# Altium schematic sheet ZynqPSDDR.SchDoc: Zynq PS DDR
size A3; Author: Carlos Barreiro; Organization: Escuela Técnica Superior de Ingeniería de Sistemas Informáticos de la Universidad Politécnica de Madrid; Address1: Campus Sur de la Universidad Politécnica de Madrid; Address2: Calle de Alan Turing, s/nº; Address3: Madrid 28031; Address4: España; Revision: 1.0; SheetNumber: 1; SheetTotal: 10
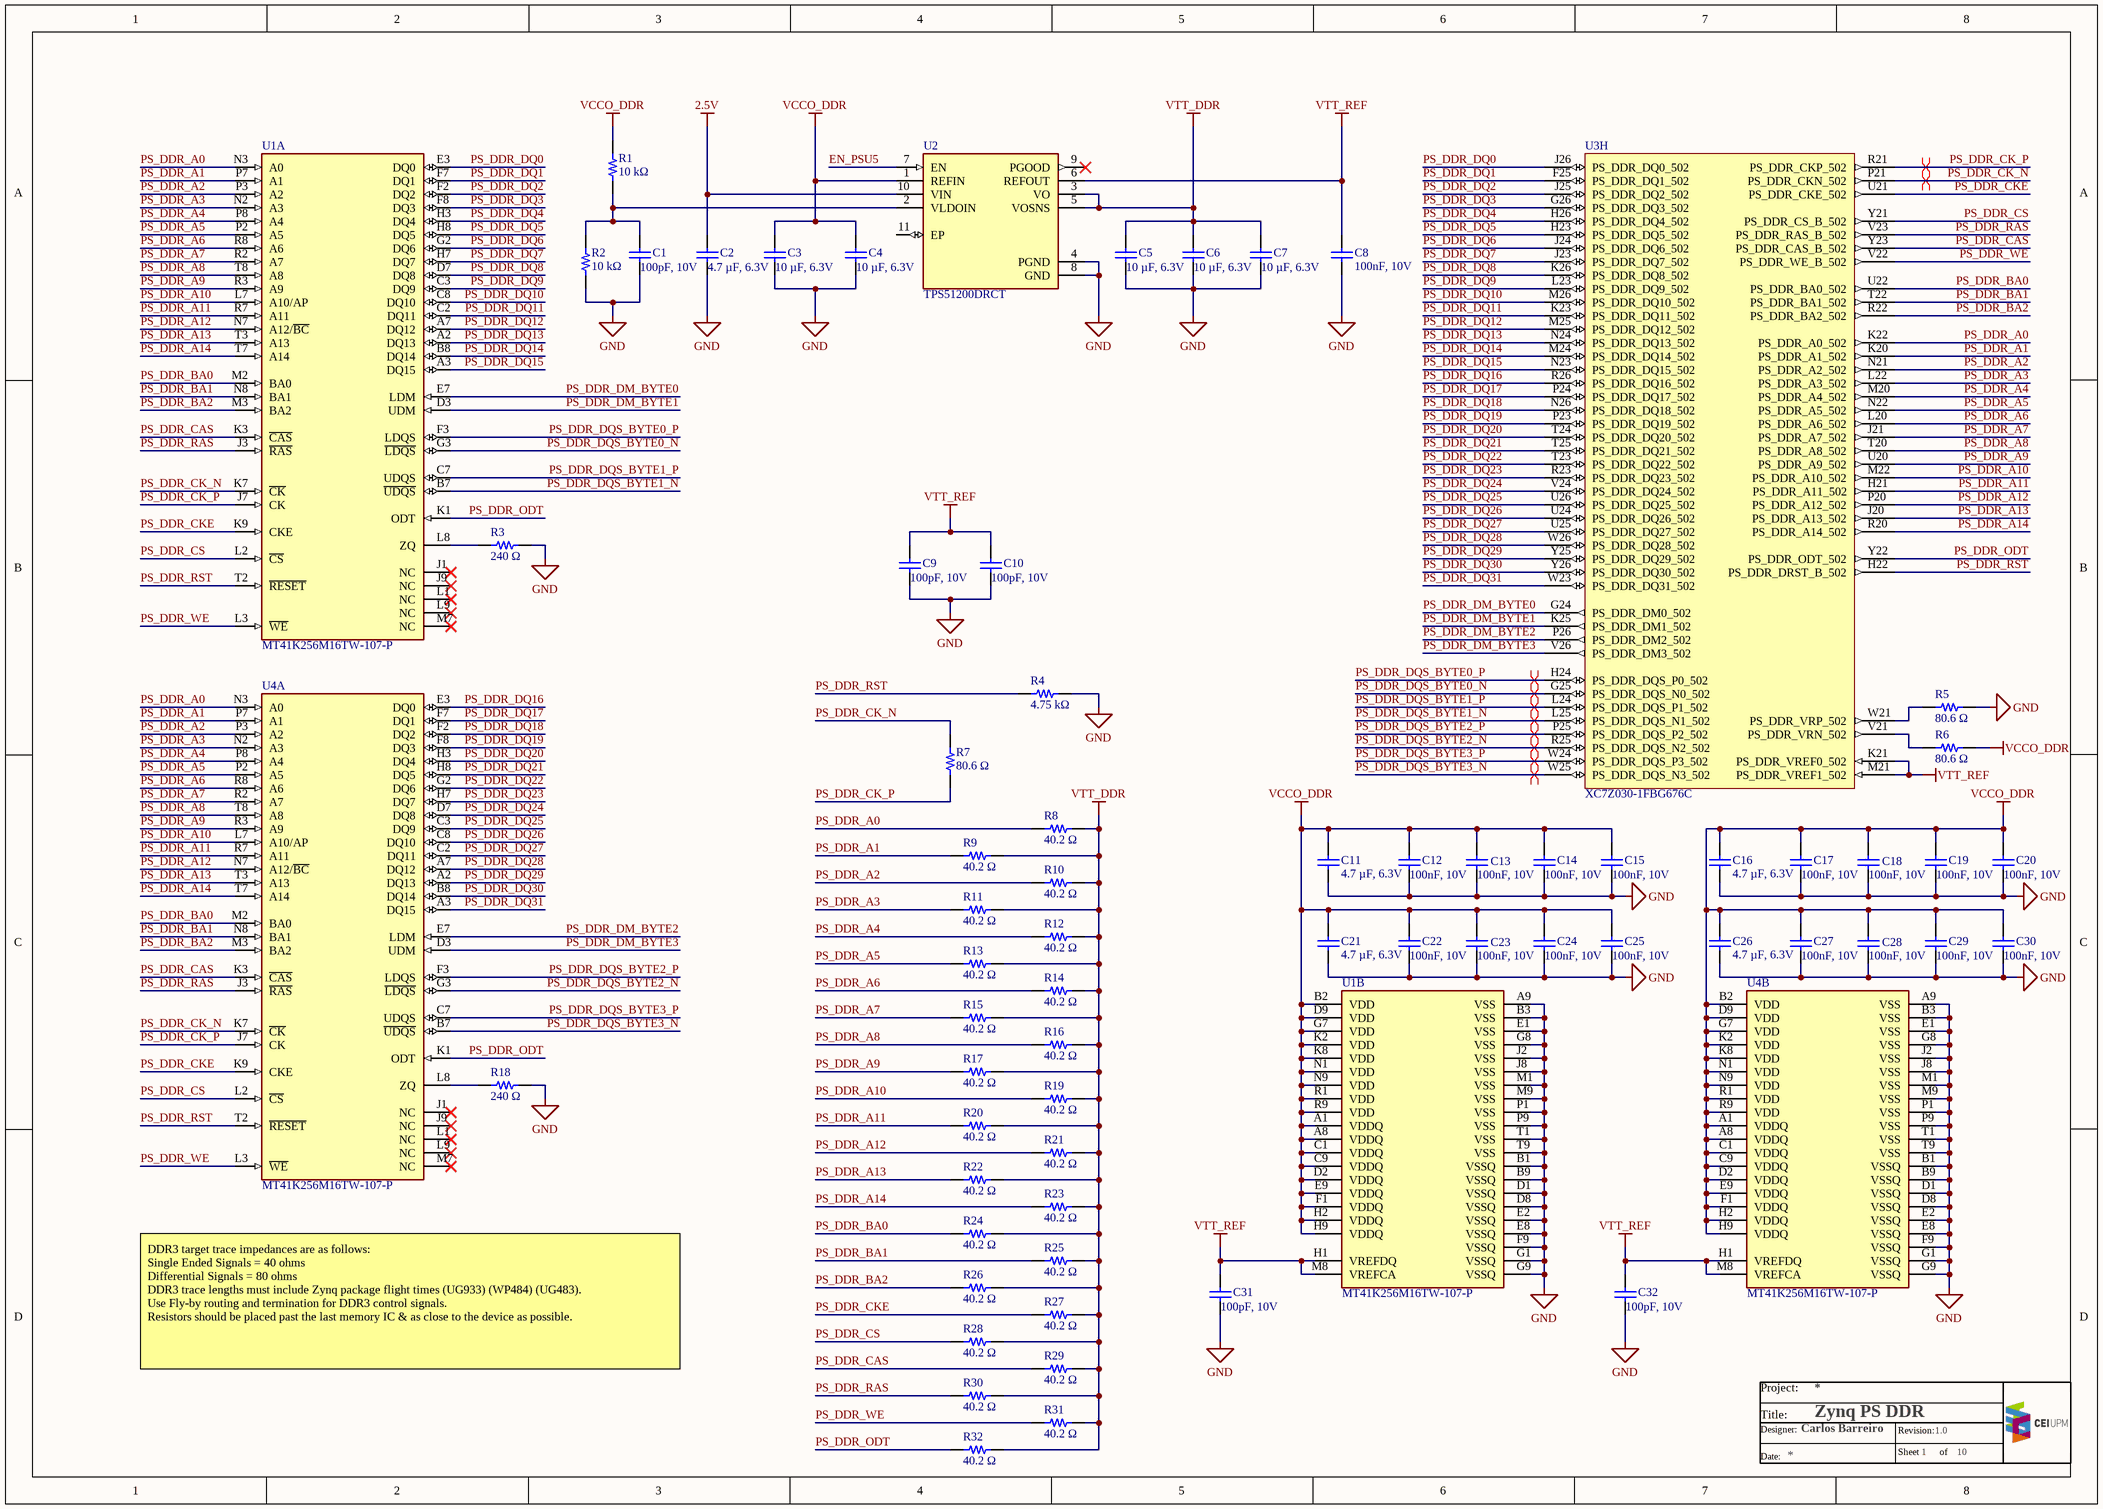
[diagram p0: ZynqPSDDR.SchDoc]

## Parts
C1  100pF, 10V  [WURTH_WCAP-CSGP_0402]
C2  4.7 µF, 6.3V  [WURTH_WCAP-CSGP_0402]
C3  10 µF, 6.3V  [WURTH_WCAP-CSGP_0402]
C4  10 µF, 6.3V  [WURTH_WCAP-CSGP_0402]
C5  10 µF, 6.3V  [WURTH_WCAP-CSGP_0402]
C6  10 µF, 6.3V  [WURTH_WCAP-CSGP_0402]
C7  10 µF, 6.3V  [WURTH_WCAP-CSGP_0402]
C8  100nF, 10V  [WURTH_WCAP-CSGP_0402]
C9  100pF, 10V  [WURTH_WCAP-CSGP_0402]
C10  100pF, 10V  [WURTH_WCAP-CSGP_0402]
C11  4.7 µF, 6.3V  [WURTH_WCAP-CSGP_0402]
C12  100nF, 10V  [WURTH_WCAP-CSGP_0402]
C13  100nF, 10V  [WURTH_WCAP-CSGP_0402]
C14  100nF, 10V  [WURTH_WCAP-CSGP_0402]
C15  100nF, 10V  [WURTH_WCAP-CSGP_0402]
C16  4.7 µF, 6.3V  [WURTH_WCAP-CSGP_0402]
C17  100nF, 10V  [WURTH_WCAP-CSGP_0402]
C18  100nF, 10V  [WURTH_WCAP-CSGP_0402]
C19  100nF, 10V  [WURTH_WCAP-CSGP_0402]
C20  100nF, 10V  [WURTH_WCAP-CSGP_0402]
C21  4.7 µF, 6.3V  [WURTH_WCAP-CSGP_0402]
C22  100nF, 10V  [WURTH_WCAP-CSGP_0402]
C23  100nF, 10V  [WURTH_WCAP-CSGP_0402]
C24  100nF, 10V  [WURTH_WCAP-CSGP_0402]
C25  100nF, 10V  [WURTH_WCAP-CSGP_0402]
C26  4.7 µF, 6.3V  [WURTH_WCAP-CSGP_0402]
C27  100nF, 10V  [WURTH_WCAP-CSGP_0402]
C28  100nF, 10V  [WURTH_WCAP-CSGP_0402]
C29  100nF, 10V  [WURTH_WCAP-CSGP_0402]
C30  100nF, 10V  [WURTH_WCAP-CSGP_0402]
C31  100pF, 10V  [WURTH_WCAP-CSGP_0402]
C32  100pF, 10V  [WURTH_WCAP-CSGP_0402]
R1  10 kΩ  [PANASONIC_ERJ2G_0402]
R2  10 kΩ  [PANASONIC_ERJ2G_0402]
R3  240 Ω  [PANASONIC_ERJ2G_0402]
R4  4.75 kΩ  [PANASONIC_ERJ2G_0402]
R5  80.6 Ω  [PANASONIC_ERJ2G_0402]
R6  80.6 Ω  [PANASONIC_ERJ2G_0402]
R7  80.6 Ω  [PANASONIC_ERJ2G_0402]
R8  40.2 Ω  [PANASONIC_ERJ2G_0402]
R9  40.2 Ω  [PANASONIC_ERJ2G_0402]
R10  40.2 Ω  [PANASONIC_ERJ2G_0402]
R11  40.2 Ω  [PANASONIC_ERJ2G_0402]
R12  40.2 Ω  [PANASONIC_ERJ2G_0402]
R13  40.2 Ω  [PANASONIC_ERJ2G_0402]
R14  40.2 Ω  [PANASONIC_ERJ2G_0402]
R15  40.2 Ω  [PANASONIC_ERJ2G_0402]
R16  40.2 Ω  [PANASONIC_ERJ2G_0402]
R17  40.2 Ω  [PANASONIC_ERJ2G_0402]
R18  240 Ω  [PANASONIC_ERJ2G_0402]
R19  40.2 Ω  [PANASONIC_ERJ2G_0402]
R20  40.2 Ω  [PANASONIC_ERJ2G_0402]
R21  40.2 Ω  [PANASONIC_ERJ2G_0402]
R22  40.2 Ω  [PANASONIC_ERJ2G_0402]
R23  40.2 Ω  [PANASONIC_ERJ2G_0402]
R24  40.2 Ω  [PANASONIC_ERJ2G_0402]
R25  40.2 Ω  [PANASONIC_ERJ2G_0402]
R26  40.2 Ω  [PANASONIC_ERJ2G_0402]
R27  40.2 Ω  [PANASONIC_ERJ2G_0402]
R28  40.2 Ω  [PANASONIC_ERJ2G_0402]
R29  40.2 Ω  [PANASONIC_ERJ2G_0402]
R30  40.2 Ω  [PANASONIC_ERJ2G_0402]
R31  40.2 Ω  [PANASONIC_ERJ2G_0402]
R32  40.2 Ω  [PANASONIC_ERJ2G_0402]
U1  MT41K256M16TW-107-P  [Micron_TW]  (parts A,B of 2)
U2  TPS51200DRCT  [TEXAS_VSON10]
U3  XC7Z030-1FBG676C  [XILINX_FBG676]  (part H of 14)
U4  MT41K256M16TW-107-P  [Micron_TW]  (parts A,B of 2)

## Nets
2.5V: C2.2 U2.10(VIN)
GND: C1.1 C2.1 C3.1 C4.1 C5.1 C6.1 C7.1 C8.1 C9.1 C10.1 C11.1 C12.1 C13.1 C14.1 C15.1 C16.1 C17.1 C18.1 C19.1 C20.1 C21.1 C22.1 C23.1 C24.1 C25.1 C26.1 C27.1 C28.1 C29.1 C30.1 C31.1 C32.1 R2.1 R3.2 R4.2 R5.1 R18.2 U1.A9(VSS) U1.B1(VSSQ) U1.B3(VSS) U1.B9(VSSQ) U1.D1(VSSQ) U1.D8(VSSQ) U1.E1(VSS) U1.E2(VSSQ) U1.E8(VSSQ) U1.F9(VSSQ) U1.G1(VSSQ) U1.G8(VSS) U1.G9(VSSQ) U1.J2(VSS) U1.J8(VSS) U1.M1(VSS) U1.M9(VSS) U1.P1(VSS) U1.P9(VSS) U1.T1(VSS) U1.T9(VSS) U2.4(PGND) U2.8(GND) U4.A9(VSS) U4.B1(VSSQ) U4.B3(VSS) U4.B9(VSSQ) U4.D1(VSSQ) U4.D8(VSSQ) U4.E1(VSS) U4.E2(VSSQ) U4.E8(VSSQ) U4.F9(VSSQ) U4.G1(VSSQ) U4.G8(VSS) U4.G9(VSSQ) U4.J2(VSS) U4.J8(VSS) U4.M1(VSS) U4.M9(VSS) U4.P1(VSS) U4.P9(VSS) U4.T1(VSS) U4.T9(VSS)
VCCO_DDR: C3.2 C4.2 C11.2 C12.2 C13.2 C14.2 C15.2 C16.2 C17.2 C18.2 C19.2 C20.2 C21.2 C22.2 C23.2 C24.2 C25.2 C26.2 C27.2 C28.2 C29.2 C30.2 R1.2 R6.1 U1.A1(VDDQ) U1.A8(VDDQ) U1.B2(VDD) U1.C1(VDDQ) U1.C9(VDDQ) U1.D2(VDDQ) U1.D9(VDD) U1.E9(VDDQ) U1.F1(VDDQ) U1.G7(VDD) U1.H2(VDDQ) U1.H9(VDDQ) U1.K2(VDD) U1.K8(VDD) U1.N1(VDD) U1.N9(VDD) U1.R1(VDD) U1.R9(VDD) U2.1(REFIN) U4.A1(VDDQ) U4.A8(VDDQ) U4.B2(VDD) U4.C1(VDDQ) U4.C9(VDDQ) U4.D2(VDDQ) U4.D9(VDD) U4.E9(VDDQ) U4.F1(VDDQ) U4.G7(VDD) U4.H2(VDDQ) U4.H9(VDDQ) U4.K2(VDD) U4.K8(VDD) U4.N1(VDD) U4.N9(VDD) U4.R1(VDD) U4.R9(VDD)
VTT_DDR: C5.2 C6.2 C7.2 R8.2 R9.2 R10.2 R11.2 R12.2 R13.2 R14.2 R15.2 R16.2 R17.2 R19.2 R20.2 R21.2 R22.2 R23.2 R24.2 R25.2 R26.2 R27.2 R28.2 R29.2 R30.2 R31.2 R32.2 U2.3(VO) U2.5(VOSNS)
VTT_REF: C8.2 C9.2 C10.2 C31.2 C32.2 U1.H1(VREFDQ) U1.M8(VREFCA) U2.6(REFOUT) U3.K21(PS_DDR_VREF0_502) U3.M21(PS_DDR_VREF1_502) U4.H1(VREFDQ) U4.M8(VREFCA)
EN_PSU5: U2.7(EN)
PS_DDR_A0: R8.1 U1.N3(A0) U3.K22(PS_DDR_A0_502) U4.N3(A0)
PS_DDR_A1: R9.1 U1.P7(A1) U3.K20(PS_DDR_A1_502) U4.P7(A1)
PS_DDR_A2: R10.1 U1.P3(A2) U3.N21(PS_DDR_A2_502) U4.P3(A2)
PS_DDR_A3: R11.1 U1.N2(A3) U3.L22(PS_DDR_A3_502) U4.N2(A3)
PS_DDR_A4: R12.1 U1.P8(A4) U3.M20(PS_DDR_A4_502) U4.P8(A4)
PS_DDR_A5: R13.1 U1.P2(A5) U3.N22(PS_DDR_A5_502) U4.P2(A5)
PS_DDR_A6: R14.1 U1.R8(A6) U3.L20(PS_DDR_A6_502) U4.R8(A6)
PS_DDR_A7: R15.1 U1.R2(A7) U3.J21(PS_DDR_A7_502) U4.R2(A7)
PS_DDR_A8: R16.1 U1.T8(A8) U3.T20(PS_DDR_A8_502) U4.T8(A8)
PS_DDR_A9: R17.1 U1.R3(A9) U3.U20(PS_DDR_A9_502) U4.R3(A9)
PS_DDR_A10: R19.1 U1.L7(A10/AP) U3.M22(PS_DDR_A10_502) U4.L7(A10/AP)
PS_DDR_A11: R20.1 U1.R7(A11) U3.H21(PS_DDR_A11_502) U4.R7(A11)
PS_DDR_A12: R21.1 U1.N7(A12/~{BC}) U3.P20(PS_DDR_A12_502) U4.N7(A12/~{BC})
PS_DDR_A13: R22.1 U1.T3(A13) U3.J20(PS_DDR_A13_502) U4.T3(A13)
PS_DDR_A14: R23.1 U1.T7(A14) U3.R20(PS_DDR_A14_502) U4.T7(A14)
PS_DDR_BA0: R24.1 U1.M2(BA0) U3.U22(PS_DDR_BA0_502) U4.M2(BA0)
PS_DDR_BA1: R25.1 U1.N8(BA1) U3.T22(PS_DDR_BA1_502) U4.N8(BA1)
PS_DDR_BA2: R26.1 U1.M3(BA2) U3.R22(PS_DDR_BA2_502) U4.M3(BA2)
PS_DDR_CAS: R29.1 U1.K3(~{CAS}) U3.Y23(PS_DDR_CAS_B_502) U4.K3(~{CAS})
PS_DDR_CK_N: R7.2 U1.K7(~{CK}) U3.P21(PS_DDR_CKN_502) U4.K7(~{CK})
PS_DDR_CK_P: R7.1 U1.J7(CK) U3.R21(PS_DDR_CKP_502) U4.J7(CK)
PS_DDR_CKE: R27.1 U1.K9(CKE) U3.U21(PS_DDR_CKE_502) U4.K9(CKE)
PS_DDR_CS: R28.1 U1.L2(~{CS}) U3.Y21(PS_DDR_CS_B_502) U4.L2(~{CS})
PS_DDR_DM_BYTE0: U1.E7(LDM) U3.G24(PS_DDR_DM0_502)
PS_DDR_DM_BYTE1: U1.D3(UDM) U3.K25(PS_DDR_DM1_502)
PS_DDR_DM_BYTE2: U3.P26(PS_DDR_DM2_502) U4.E7(LDM)
PS_DDR_DM_BYTE3: U3.V26(PS_DDR_DM3_502) U4.D3(UDM)
PS_DDR_DQ0: U1.E3(DQ0) U3.J26(PS_DDR_DQ0_502)
PS_DDR_DQ1: U1.F7(DQ1) U3.F25(PS_DDR_DQ1_502)
PS_DDR_DQ2: U1.F2(DQ2) U3.J25(PS_DDR_DQ2_502)
PS_DDR_DQ3: U1.F8(DQ3) U3.G26(PS_DDR_DQ3_502)
PS_DDR_DQ4: U1.H3(DQ4) U3.H26(PS_DDR_DQ4_502)
PS_DDR_DQ5: U1.H8(DQ5) U3.H23(PS_DDR_DQ5_502)
PS_DDR_DQ6: U1.G2(DQ6) U3.J24(PS_DDR_DQ6_502)
PS_DDR_DQ7: U1.H7(DQ7) U3.J23(PS_DDR_DQ7_502)
PS_DDR_DQ8: U1.D7(DQ8) U3.K26(PS_DDR_DQ8_502)
PS_DDR_DQ9: U1.C3(DQ9) U3.L23(PS_DDR_DQ9_502)
PS_DDR_DQ10: U1.C8(DQ10) U3.M26(PS_DDR_DQ10_502)
PS_DDR_DQ11: U1.C2(DQ11) U3.K23(PS_DDR_DQ11_502)
PS_DDR_DQ12: U1.A7(DQ12) U3.M25(PS_DDR_DQ12_502)
PS_DDR_DQ13: U1.A2(DQ13) U3.N24(PS_DDR_DQ13_502)
PS_DDR_DQ14: U1.B8(DQ14) U3.M24(PS_DDR_DQ14_502)
PS_DDR_DQ15: U1.A3(DQ15) U3.N23(PS_DDR_DQ15_502)
PS_DDR_DQ16: U3.R26(PS_DDR_DQ16_502) U4.E3(DQ0)
PS_DDR_DQ17: U3.P24(PS_DDR_DQ17_502) U4.F7(DQ1)
PS_DDR_DQ18: U3.N26(PS_DDR_DQ18_502) U4.F2(DQ2)
PS_DDR_DQ19: U3.P23(PS_DDR_DQ19_502) U4.F8(DQ3)
PS_DDR_DQ20: U3.T24(PS_DDR_DQ20_502) U4.H3(DQ4)
PS_DDR_DQ21: U3.T25(PS_DDR_DQ21_502) U4.H8(DQ5)
PS_DDR_DQ22: U3.T23(PS_DDR_DQ22_502) U4.G2(DQ6)
PS_DDR_DQ23: U3.R23(PS_DDR_DQ23_502) U4.H7(DQ7)
PS_DDR_DQ24: U3.V24(PS_DDR_DQ24_502) U4.D7(DQ8)
PS_DDR_DQ25: U3.U26(PS_DDR_DQ25_502) U4.C3(DQ9)
PS_DDR_DQ26: U3.U24(PS_DDR_DQ26_502) U4.C8(DQ10)
PS_DDR_DQ27: U3.U25(PS_DDR_DQ27_502) U4.C2(DQ11)
PS_DDR_DQ28: U3.W26(PS_DDR_DQ28_502) U4.A7(DQ12)
PS_DDR_DQ29: U3.Y25(PS_DDR_DQ29_502) U4.A2(DQ13)
PS_DDR_DQ30: U3.Y26(PS_DDR_DQ30_502) U4.B8(DQ14)
PS_DDR_DQ31: U3.W23(PS_DDR_DQ31_502) U4.A3(DQ15)
PS_DDR_DQS_BYTE0_N: U1.G3(~{LDQS}) U3.G25(PS_DDR_DQS_N0_502)
PS_DDR_DQS_BYTE0_P: U1.F3(LDQS) U3.H24(PS_DDR_DQS_P0_502)
PS_DDR_DQS_BYTE1_N: U1.B7(~{UDQS}) U3.L25(PS_DDR_DQS_N1_502)
PS_DDR_DQS_BYTE1_P: U1.C7(UDQS) U3.L24(PS_DDR_DQS_P1_502)
PS_DDR_DQS_BYTE2_N: U3.R25(PS_DDR_DQS_N2_502) U4.G3(~{LDQS})
PS_DDR_DQS_BYTE2_P: U3.P25(PS_DDR_DQS_P2_502) U4.F3(LDQS)
PS_DDR_DQS_BYTE3_N: U3.W25(PS_DDR_DQS_N3_502) U4.B7(~{UDQS})
PS_DDR_DQS_BYTE3_P: U3.W24(PS_DDR_DQS_P3_502) U4.C7(UDQS)
PS_DDR_ODT: R32.1 U1.K1(ODT) U3.Y22(PS_DDR_ODT_502) U4.K1(ODT)
PS_DDR_RAS: R30.1 U1.J3(~{RAS}) U3.V23(PS_DDR_RAS_B_502) U4.J3(~{RAS})
PS_DDR_RST: R4.1 U1.T2(~{RESET}) U3.H22(PS_DDR_DRST_B_502) U4.T2(~{RESET})
PS_DDR_WE: R31.1 U1.L3(~{WE}) U3.V22(PS_DDR_WE_B_502) U4.L3(~{WE})
NetC1_2: C1.2 R1.1 R2.2 U2.2(VLDOIN)
NetR3_1: R3.1 U1.L8(ZQ)
NetR5_2: R5.2 U3.W21(PS_DDR_VRP_502)
NetR6_2: R6.2 U3.V21(PS_DDR_VRN_502)
NetR18_1: R18.1 U4.L8(ZQ)

Not connected (* = marked no-connect by the designer): U1 J1(NC)* J9(NC)* L1(NC)* L9(NC)* M7(NC)*; U2 9(PGOOD)* 11(EP); U4 J1(NC)* J9(NC)* L1(NC)* L9(NC)* M7(NC)*

## Layout directives
differential pair: PS_DDR_CK_N, PS_DDR_CK_P, PS_DDR_DQS_BYTE0_N, PS_DDR_DQS_BYTE0_P, PS_DDR_DQS_BYTE1_N, PS_DDR_DQS_BYTE1_P, PS_DDR_DQS_BYTE2_N, PS_DDR_DQS_BYTE2_P, PS_DDR_DQS_BYTE3_N, PS_DDR_DQS_BYTE3_P

## Notes on the sheet
- DDR3 target trace impedances are as follows:
  Single Ended Signals = 40 ohms
  Differential Signals = 80 ohms
  DDR3 trace lengths must include Zynq package flight times (UG933) (WP484) (UG483).
  Use Fly-by routing and termination for DDR3 control signals.
  Resistors should be placed past the last memory IC & as close to the device as possible.
- Project:
- Title:
- Date:
- Designer:
- Revision:
- Sheet
- of

## Library data of the parts
C1 C9 C10 C31 C32 = 885012005013: WCAP-CSGP Multilayer Ceramic Chip Capacitor, General Purpose, size 0402, NP0, 100pF, 10V; Manufacturer: Wurth Elektronik; Rated Voltage: 10VDC; Isolation Resistance  min.: 10GOhm; Capacitance Tolerance: +/-5%; Technical Reference: NP00402101J010DFCT10000; Q-Factor min.: 1000; ComponentLink1Description: Manufacturer; ComponentLink1URL: http://www.we-online.de; ComponentLink2Description: Datasheet; ComponentLink2URL: https://www.we-online.com/catalog/datasheet/885012005013.pdf; Operating Temperature: -55 to +125degC; Packaging: Tape and Reel; Manufacturer Part Number: 885012005013; Published Date: April 2021; Ceramic Type: NP0; Dissipation Factor max.: -; Height: 0.5mm; Mounting Technology: SMT; Size: 0402; Capacitance: 100pF
C2 C11 C16 C21 C26 = GRM155C80J475MEAAD: Multilayer Ceramic Capacitors MLCC, size 0402, X5R, 4.7 µF, 6.3V; Manufacturer: Murata; Rated Voltage: 6.3VDC; Ceramic Type: X6S; Capacitance Tolerance: +/-20%; Dissipation Factor max.: 10%; Capacitance: 4.7 µF; Operating Temperature: -55 to +105degC; Packaging: Tape and Reel; Manufacturer Part Number: GRM155C80J475MEAAD; Height: 0.5mm; Mounting Technology: SMT; Size: 0402; Supplier 1: Digi-Key; Supplier 2: Mouser; Supplier Part Number 1: 490-14458-1-ND; Supplier Part Number 2: 81-GRM155C80J475MEAD
C3-C7 = 885012105020: WCAP-CSGP Multilayer Ceramic Chip Capacitor, General Purpose, size 0402, X5R, 10uF, 6.3V; Manufacturer: Wurth Elektronik; Rated Voltage: 6.3VDC; Isolation Resistance  min.: 0.01GOhm; Capacitance Tolerance: +/20%; Dissipation Factor max.: 10%; Technical Reference: X5R0402106M6R3DFCT10000; ComponentLink1Description: Manufacturer; ComponentLink1URL: http://www.we-online.de; ComponentLink2Description: Datasheet; ComponentLink2URL: https://www.we-online.com/catalog/datasheet/885012105020.pdf; Operating Temperature: -55 to +85degC; Packaging: Tape and Reel; Manufacturer Part Number: 885012105020; Published Date: April 2021; Ceramic Type: X5R; Height: 0.5mm; Mounting Technology: SMT; Size: 0402; Capacitance: 10uF; Q-Factor min.: -
C8 C12-C15 C17-C20 C22-C25 C27-C30 = 885012205018: WCAP-CSGP Multilayer Ceramic Chip Capacitor, General Purpose, size 0402, X7R, 100nF, 10V; Manufacturer: Wurth Elektronik; Rated Voltage: 10VDC; Isolation Resistance  min.: 5GOhm; Capacitance Tolerance: +/-10%; Dissipation Factor max.: 5%; Technical Reference: X7R0402104K010DFCT10000; ComponentLink1Description: Manufacturer; ComponentLink1URL: http://www.we-online.de; ComponentLink2Description: Datasheet; ComponentLink2URL: https://www.we-online.com/catalog/datasheet/885012205018.pdf; Operating Temperature: -55 to +125degC; Packaging: Tape and Reel; Manufacturer Part Number: 885012205018; Published Date: April 2021; Ceramic Type: X7R; Height: 0.5mm; Mounting Technology: SMT; Size: 0402; Capacitance: 100nF; Q-Factor min.: -
R1 R2 = ERJ2RKF1002X: General Purpose Thick Film Chip Resistors; Manufacturer: Panasonic; Power (0402): 0.1 W; Limiting Voltage (0402): 50; Maximum Voltage (0402): 100; Resistance Range (Ω): 1Ω to 100MΩ; AEC 200: Grade 0; Size (0402): 2GE; ComponentLink1Description: Catalog; ComponentLink1URL: https://industrial.panasonic.com/ww/products/pt/general-purpose-chip-resistors/models?op=search&model_status_current=1&page=0#model-list-search-results; Series: ERJ; Temperature Range (ºC): -55 to +155; Supplier 1: Digi-Key; Supplier 2: Mouser; Supplier Part Number 1: P10.0KLCT-ND; Supplier Part Number 2: 667-ERJ-2RKF1002X
R3 R18 = ERJ2GEJ241X: General Purpose Thick Film Chip Resistors; Manufacturer: Panasonic; Power (0402): 0.1 W; Limiting Voltage (0402): 50; Maximum Voltage (0402): 100; Resistance Range (Ω): 1Ω to 100MΩ; AEC 200: Grade 0; Size (0402): 2GE; ComponentLink1Description: Catalog; ComponentLink1URL: https://industrial.panasonic.com/ww/products/pt/general-purpose-chip-resistors/models?op=search&model_status_current=1&page=0#model-list-search-results; Series: ERJ; Temperature Range (ºC): -55 to +155; Supplier 1: Newark; Supplier 2: Mouser; Supplier Part Number 1: 85Y7936; Supplier Part Number 2: 667-ERJ-2GEJ241X
R4 = ERJ2RKF4751X: General Purpose Thick Film Chip Resistors; Manufacturer: Panasonic; Power (0402): 0.1 W; Limiting Voltage (0402): 50; Maximum Voltage (0402): 100; Resistance Range (Ω): 1Ω to 100MΩ; AEC 200: Grade 0; Size (0402): 2GE; ComponentLink1Description: Catalog; ComponentLink1URL: https://industrial.panasonic.com/ww/products/pt/general-purpose-chip-resistors/models?op=search&model_status_current=1&page=0#model-list-search-results; Series: ERJ; Temperature Range (ºC): -55 to +155; Supplier 1: RSComponents; Supplier 2: Digi-Key; Supplier Part Number 1: 1065277; Supplier Part Number 2: P4.75KLCT-ND
R5-R7 = ERJ2RKF80R6X: General Purpose Thick Film Chip Resistors; Manufacturer: Panasonic; Power (0402): 0.1 W; Limiting Voltage (0402): 50; Maximum Voltage (0402): 100; Resistance Range (Ω): 1Ω to 100MΩ; AEC 200: Grade 0; Size (0402): 2GE; ComponentLink1Description: Catalog; ComponentLink1URL: https://industrial.panasonic.com/ww/products/pt/general-purpose-chip-resistors/models?op=search&model_status_current=1&page=0#model-list-search-results; Series: ERJ; Temperature Range (ºC): -55 to +155; Supplier 1: Digi-Key; Supplier 2: Mouser; Supplier Part Number 1: P80.6LCT-ND; Supplier Part Number 2: 667-ERJ-2RKF80R6X
R8-R17 R19-R32 = ERJ2RKF40R2X: General Purpose Thick Film Chip Resistors; Manufacturer: Panasonic; Power (0402): 0.1 W; Limiting Voltage (0402): 50; Maximum Voltage (0402): 100; Resistance Range (Ω): 1Ω to 100MΩ; AEC 200: Grade 0; Size (0402): 2GE; ComponentLink1Description: Catalog; ComponentLink1URL: https://industrial.panasonic.com/ww/products/pt/general-purpose-chip-resistors/models?op=search&model_status_current=1&page=0#model-list-search-results; Series: ERJ; Temperature Range (ºC): -55 to +155; Supplier 1: Newark; Supplier 2: Digi-Key; Supplier Part Number 1: 27AC5044; Supplier Part Number 2: P40.2LCT-ND
U1 U4 = MT41K256M16TW-107-P: DDR3L SRAM 256Mb*16; Supplier 1: Digi-Key; Supplier 2: Mouser; Supplier Part Number 1: 557-1792-ND; Supplier Part Number 2: 340-265846-TRAY
U2 = TPS51200DRCT: 3A Sink/Source DDR Termination Regulator w/ VTTREF Buffered Reference for DDR2, DDR3, DDR3L and DDR4 10-VSON -40 to 85; MF: Texas Instruments; DDR memory type: DDR, DDR2, DDR3, DDR3L, LPDDR2, LPDDR3; Control mode: D-CAP, S4/S5; Iout VDDQ (Max) (A): 20; Iq (Typ) (mA): 0.6; Output: VDDQ, VREF, VTT; Vin (Min) (V): 3; Vin (Max) (V): 28; Rating: HiRel Enhanced Product; MP: TPS51200DRCT; Package: VSON-10; Supplier 1: Digi-Key; Supplier 2: Mouser; Supplier Part Number 1: 296-23830-1-ND; Supplier Part Number 2: 595-TPS51200DRCT; Iout VTT (Max) (A): *; Operating temperature range (C): -55ºC to 125ºC
U3 = XC7Z030-1FBG676C: 667 MHz Zynq™-7000 AP SoC, 130 PS I/O, 254 FPGA I/O, 676-Ball BGA, Speed Grade 1, Commercial Grade, Pb-Free; LUTs: 78600; Extensible Block RAM (# 36Kb Blocks): 1060 KB (265); Speed Grade: -1; Flip Flops: 157200; ComponentLink5Description: Packaging and Pinout; ComponentLink4Description: Package File; ComponentLink5URL: http://www.xilinx.com/support/documentation/user_guides/ug865-Zynq-7000-Pkg-Pinout.pdf; PartNumber: XC7Z030-1FBG676C; Generic Part Number: XC7Z030; ComponentLink1Description: Datasheet; ComponentLink2Description: Package Specification; ComponentLink3URL: http://www.xilinx.com/support/documentation/data_sheets/ds191-XC7Z030-XC7Z045-data-sheet.pdf; ComponentLink1URL: http://www.xilinx.com/support/documentation/data_sheets/ds190-Zynq-7000-Overview.pdf; ComponentLink6Description: PCB and Layout Guide; ComponentLink3Description: DC and AC Switching Characteristics; ComponentLink6URL: http://www.xilinx.com/support/documentation/user_guides/ug483_7Series_PCB.pdf; RoHS: Pb-Free; ComponentLink4URL: http://www.xilinx.com/support/packagefiles/z7packages/xc7z030fbg676pkg.txt; ComponentLink2URL: http://www.xilinx.com/support/documentation/user_guides/ug475_7Series_Pkg_Pinout.pdf; PackageDescription: Flip-Chip Lidless BGA, Body 27 x 27 mm, 1.0 mm Pitch; Supplier 1: Avnet; Supplier 2: Mouser; Supplier 3: Farnell; Supplier Part Number 1: XC7Z030-1FBG676C; Supplier Part Number 2: 217-XC7Z030-1FBG676C; Supplier Part Number 3: 2828946; Package: FBG676